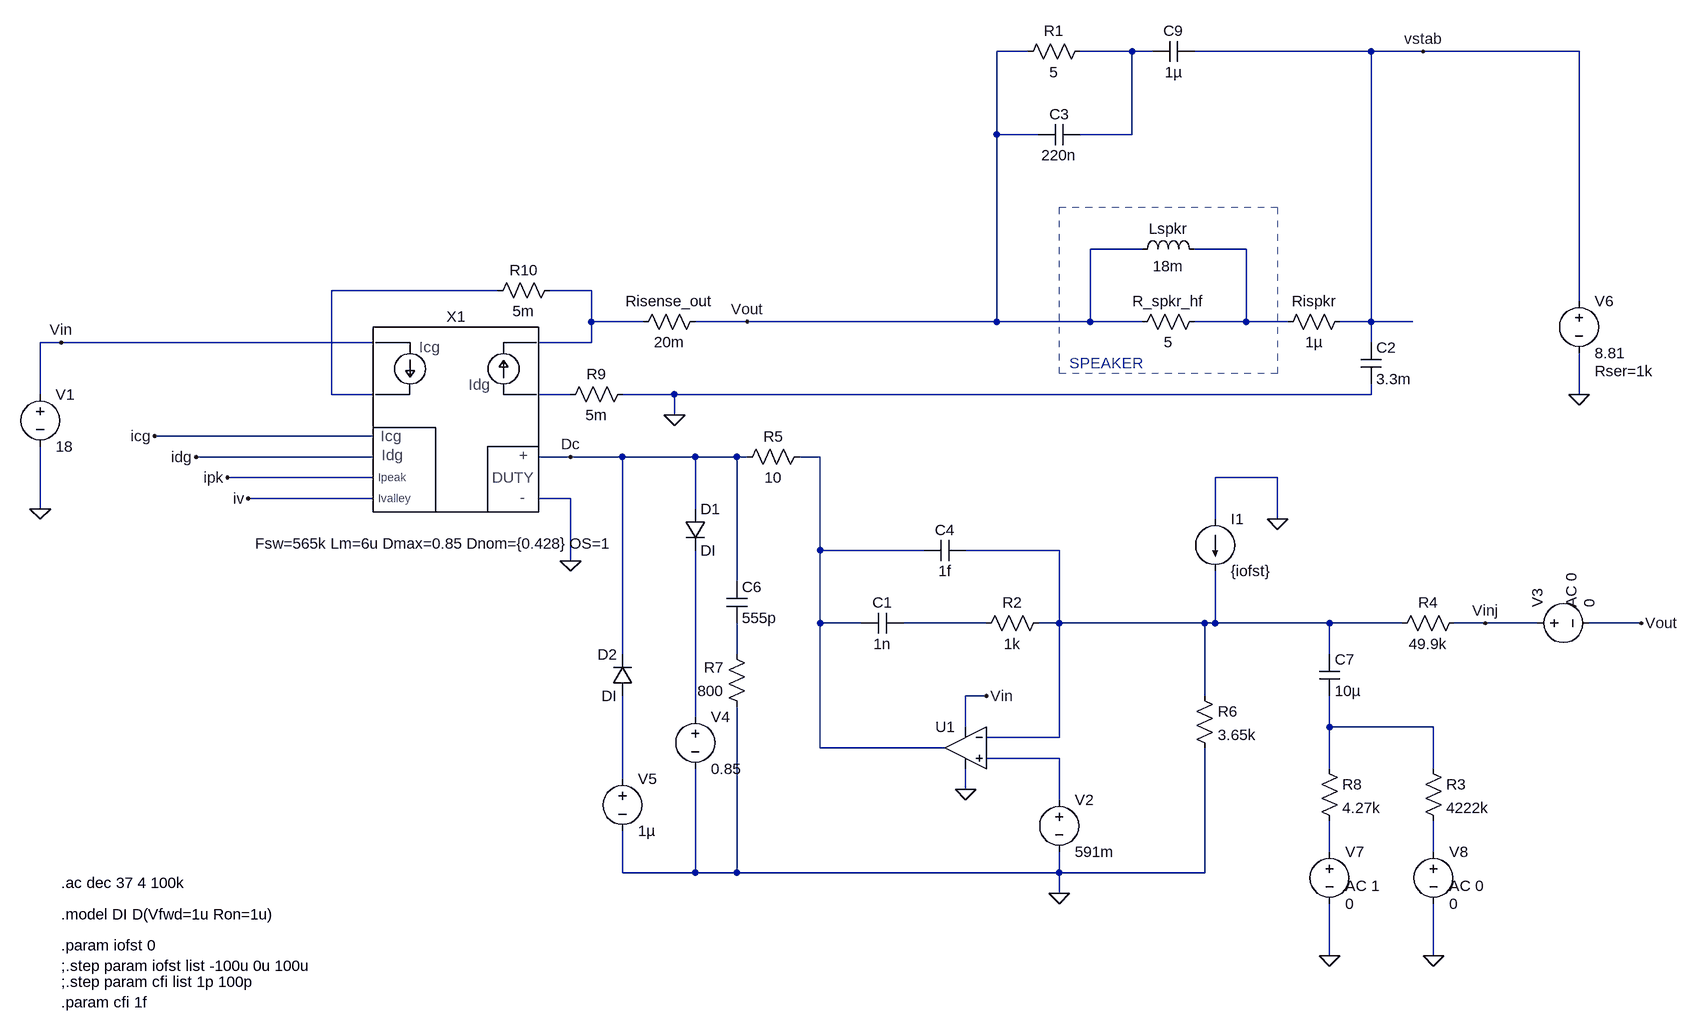
[diagram p0: schematic TPS40195_Power_Amp_AC.asc]
TPS40195_Power_Amp_AC.asc, the LTspice schematic file:
Version 4
SHEET 1 2744 1236
WIRE 1072 -384 1024 -384
WIRE 1232 -384 1152 -384
WIRE 1264 -384 1232 -384
WIRE 1600 -384 1328 -384
WIRE 1680 -384 1600 -384
WIRE 1920 -384 1680 -384
WIRE 1024 -256 1024 -384
WIRE 1088 -256 1024 -256
WIRE 1232 -256 1232 -384
WIRE 1232 -256 1152 -256
WIRE 1248 -80 1168 -80
WIRE 1408 -80 1328 -80
WIRE 256 -16 0 -16
WIRE 400 -16 336 -16
WIRE 1920 0 1920 -384
WIRE 400 32 400 -16
WIRE 480 32 400 32
WIRE 640 32 560 32
WIRE 1024 32 1024 -256
WIRE 1024 32 640 32
WIRE 1168 32 1168 -80
WIRE 1168 32 1024 32
WIRE 1248 32 1168 32
WIRE 1408 32 1408 -80
WIRE 1408 32 1328 32
WIRE 1472 32 1408 32
WIRE 1600 32 1600 -384
WIRE 1600 32 1552 32
WIRE 1664 32 1600 32
WIRE -416 64 -448 64
WIRE 64 64 -416 64
WIRE 400 64 400 32
WIRE 400 64 320 64
WIRE 1600 64 1600 32
WIRE -448 144 -448 64
WIRE 0 144 0 -16
WIRE 64 144 0 144
WIRE 368 144 320 144
WIRE 528 144 448 144
WIRE 1600 144 1600 128
WIRE 1600 144 528 144
WIRE 1920 144 1920 80
WIRE 528 176 528 144
WIRE 64 208 -272 208
WIRE 64 240 -208 240
WIRE 368 240 320 240
WIRE 448 240 368 240
WIRE 560 240 448 240
WIRE 624 240 560 240
WIRE 640 240 624 240
WIRE 752 240 720 240
WIRE 64 272 -160 272
WIRE 1456 272 1360 272
WIRE 64 304 -128 304
WIRE 368 304 320 304
WIRE -448 320 -448 224
WIRE 560 320 560 240
WIRE 1360 336 1360 272
WIRE 1456 336 1456 272
WIRE 752 384 752 240
WIRE 912 384 752 384
WIRE 1120 384 976 384
WIRE 368 400 368 304
WIRE 624 432 624 240
WIRE 752 496 752 384
WIRE 816 496 752 496
WIRE 1008 496 880 496
WIRE 1120 496 1120 384
WIRE 1120 496 1088 496
WIRE 1344 496 1120 496
WIRE 1360 496 1360 416
WIRE 1360 496 1344 496
WIRE 1536 496 1360 496
WIRE 1648 496 1536 496
WIRE 1776 496 1728 496
WIRE 1856 496 1776 496
WIRE 2016 496 1936 496
WIRE 448 544 448 240
WIRE 624 544 624 496
WIRE 1536 544 1536 496
WIRE 1008 608 976 608
WIRE 1344 608 1344 496
WIRE 560 640 560 384
WIRE 976 656 976 608
WIRE 1536 656 1536 608
WIRE 1696 656 1536 656
WIRE 1120 672 1120 496
WIRE 1120 672 1008 672
WIRE 752 688 752 496
WIRE 944 688 752 688
WIRE 1120 704 1008 704
WIRE 1536 720 1536 656
WIRE 1696 720 1696 656
WIRE 448 736 448 608
WIRE 976 752 976 720
WIRE 1120 768 1120 704
WIRE 1536 848 1536 800
WIRE 1696 848 1696 800
WIRE 448 880 448 816
WIRE 560 880 560 720
WIRE 560 880 448 880
WIRE 624 880 624 624
WIRE 624 880 560 880
WIRE 1120 880 1120 848
WIRE 1120 880 624 880
WIRE 1344 880 1344 688
WIRE 1344 880 1120 880
WIRE 1120 912 1120 880
WIRE 1536 1008 1536 928
WIRE 1696 1008 1696 928
FLAG 528 176 0
FLAG -448 320 0
FLAG 640 32 Vout
FLAG -416 64 Vin
FLAG 368 240 Dc
FLAG -272 208 icg
FLAG -208 240 idg
FLAG -160 272 ipk
FLAG -128 304 iv
FLAG 368 400 0
FLAG 976 752 0
FLAG 1008 608 Vin
FLAG 1120 912 0
FLAG 2016 496 Vout
FLAG 1776 496 Vinj
FLAG 1920 144 0
FLAG 1536 1008 0
FLAG 1680 -384 vstab
FLAG 1456 336 0
FLAG 1696 1008 0
DATAFLAG -208 208 ""
DATAFLAG -112 240 ""
DATAFLAG -112 272 ""
DATAFLAG -32 304 ""
DATAFLAG 1088 32 ""
DATAFLAG 1664 32 ""
DATAFLAG 480 240 ""
DATAFLAG 1120 384 ""
DATAFLAG 784 384 ""
SYMBOL voltage -448 128 R0
WINDOW 123 0 0 Left 0
WINDOW 39 0 0 Left 0
SYMATTR InstName V1
SYMATTR Value 18
SYMBOL Duty_Control_IRM 192 144 R0
WINDOW 39 -309 229 Left 2
SYMATTR SpiceLine Fsw=565k Lm=6u Dmax=0.85 Dnom={0.428} OS=1
SYMATTR InstName X1
SYMBOL ind 1232 -64 R270
WINDOW 0 32 56 VTop 2
WINDOW 3 5 56 VBottom 2
SYMATTR InstName Lspkr
SYMATTR Value 18m
SYMATTR SpiceLine Rser=100k
SYMBOL cap 1584 64 R0
SYMATTR InstName C2
SYMATTR Value 3.3m
SYMATTR SpiceLine Rser=20m
SYMBOL cap 1152 -272 R90
WINDOW 0 0 32 VBottom 2
WINDOW 3 32 32 VTop 2
SYMATTR InstName C3
SYMATTR Value 220n
SYMBOL res 1168 -400 R90
WINDOW 0 0 56 VBottom 2
WINDOW 3 32 56 VTop 2
SYMATTR InstName R1
SYMATTR Value 5
SYMBOL Opamps\\UniversalOpamp2 976 688 M0
SYMATTR InstName U1
SYMATTR Value2 Avol=1k GBW=7Meg Slew=10Meg
SYMATTR SpiceLine ilimit=25m rail=0 Vos=0 phimargin=68
SYMBOL voltage 1120 752 R0
WINDOW 123 0 0 Left 0
WINDOW 39 0 0 Left 0
SYMATTR InstName V2
SYMATTR Value 591m
SYMBOL cap 880 480 R90
WINDOW 0 0 32 VBottom 2
WINDOW 3 32 32 VTop 2
SYMATTR InstName C1
SYMATTR Value 1n
SYMBOL res 1104 480 R90
WINDOW 0 0 56 VBottom 2
WINDOW 3 32 56 VTop 2
SYMATTR InstName R2
SYMATTR Value 1k
SYMBOL cap 976 368 R90
WINDOW 0 0 32 VBottom 2
WINDOW 3 32 32 VTop 2
SYMATTR InstName C4
SYMATTR Value 1f
SYMBOL res 1744 480 R90
WINDOW 0 0 56 VBottom 2
WINDOW 3 32 56 VTop 2
SYMATTR InstName R4
SYMATTR Value 49.9k
SYMBOL res 736 224 R90
WINDOW 0 0 56 VBottom 2
WINDOW 3 32 56 VTop 2
SYMATTR InstName R5
SYMATTR Value 10
SYMBOL res 1328 592 R0
SYMATTR InstName R6
SYMATTR Value 3.65k
SYMBOL voltage 1840 496 R270
WINDOW 123 24 68 Left 2
WINDOW 39 0 0 Left 0
SYMATTR Value2 AC 0
SYMATTR InstName V3
SYMATTR Value 0
SYMBOL diode 544 320 R0
SYMATTR InstName D1
SYMATTR Value DI
SYMBOL voltage 560 624 R0
WINDOW 123 0 0 Left 0
WINDOW 39 0 0 Left 0
SYMATTR InstName V4
SYMATTR Value 0.85
SYMBOL diode 464 608 R180
WINDOW 0 24 64 Left 2
WINDOW 3 24 0 Left 2
SYMATTR InstName D2
SYMATTR Value DI
SYMBOL voltage 448 720 R0
WINDOW 123 0 0 Left 0
WINDOW 39 0 0 Left 0
SYMATTR InstName V5
SYMATTR Value 1µ
SYMBOL voltage 1920 -16 R0
WINDOW 123 0 0 Left 0
WINDOW 39 24 124 Left 2
SYMATTR SpiceLine Rser=1k
SYMATTR InstName V6
SYMATTR Value 8.81
SYMBOL cap 608 432 R0
SYMATTR InstName C6
SYMATTR Value 555p
SYMBOL cap 1520 544 R0
SYMATTR InstName C7
SYMATTR Value 10µ
SYMBOL res 1520 704 R0
SYMATTR InstName R8
SYMATTR Value 4.27k
SYMBOL res 464 128 R90
WINDOW 0 0 56 VBottom 2
WINDOW 3 32 56 VTop 2
SYMATTR InstName R9
SYMATTR Value 5m
SYMBOL res 352 -32 R90
WINDOW 0 0 56 VBottom 2
WINDOW 3 32 56 VTop 2
SYMATTR InstName R10
SYMATTR Value 5m
SYMBOL res 1344 16 R90
WINDOW 0 0 56 VBottom 2
WINDOW 3 32 56 VTop 2
SYMATTR InstName R_spkr_hf
SYMATTR Value 5
SYMBOL cap 1328 -400 R90
WINDOW 0 0 32 VBottom 2
WINDOW 3 32 32 VTop 2
SYMATTR InstName C9
SYMATTR Value 1µ
SYMBOL voltage 1536 832 R0
WINDOW 123 24 68 Left 2
WINDOW 39 0 0 Left 0
SYMATTR Value2 AC 1
SYMATTR InstName V7
SYMATTR Value 0
SYMBOL current 1360 336 R0
WINDOW 123 0 0 Left 0
WINDOW 39 0 0 Left 0
SYMATTR InstName I1
SYMATTR Value {iofst}
SYMBOL res 464 48 R270
WINDOW 0 32 56 VTop 2
WINDOW 3 0 56 VBottom 2
SYMATTR InstName Risense_out
SYMATTR Value 20m
SYMBOL res 1456 48 R270
WINDOW 0 32 56 VTop 2
WINDOW 3 0 56 VBottom 2
SYMATTR InstName Rispkr
SYMATTR Value 1µ
SYMBOL res 1680 704 R0
SYMATTR InstName R3
SYMATTR Value 4222k
SYMBOL voltage 1696 832 R0
WINDOW 123 24 68 Left 2
WINDOW 39 0 0 Left 0
SYMATTR Value2 AC 0
SYMATTR InstName V8
SYMATTR Value 0
SYMBOL res 640 640 R180
WINDOW 0 36 76 Left 2
WINDOW 3 36 40 Left 2
SYMATTR InstName R7
SYMATTR Value 800
TEXT -416 944 Left 2 !.model DI D(Vfwd=1u Ron=1u)
TEXT -416 896 Left 2 !.ac dec 37 4 100k
TEXT -416 992 Left 2 !.param iofst 0\n;.step param iofst list -100u 0u 100u
TEXT 1136 96 Left 2 ;SPEAKER
TEXT -416 1048 Left 2 !;.step param cfi list 1p 100p\n.param cfi 1f
RECTANGLE Normal 1456 112 1120 -144 2

The netlist it stands for:
* TPS40195_Power_Amp_AC.asc
V1 Vin 0 18
XX1 Dc 0 Vin N003 N004 N005 icg idg ipk iv Duty_Control_IRM params: Fsw=565k Lm=6u Dmax=0.85 Dnom={0.428} OS=1  ; pins D+ D- Vcg+ Vcg- Vdg+ Vdg- Icharge Idischarge Ipeak Ivalley
Lspkr Vout N002 18m Rser=100k
C2 vstab 0 3.3m Rser=20m
C3 N001 Vout 220n
R1 N001 Vout 5
XU1 N012 N007 Vin 0 N006 level.2 Avol=1k GBW=7Meg Slew=10Meg ilimit=25m rail=0 Vos=0 phimargin=68 en=0 enk=0 in=0 ink=0 Rin=500Meg  ; pins IN+ IN- V+ V- OUT
V2 N012 0 591m
C1 N008 N006 1n
R2 N007 N008 1k
C4 N007 N006 1f
R4 Vinj N007 49.9k
R5 N006 Dc 10
R6 N007 0 3.65k
V3 Vinj Vout 0 AC 0
D1 Dc N010 DI
V4 N010 0 0.85
D2 N013 Dc DI
V5 N013 0 1µ
V6 vstab 0 8.81 Rser=1k
C6 Dc N009 555p
C7 N007 N011 10µ
R8 N011 N014 4.27k
R9 0 N005 5m
R10 N004 N003 5m
R_spkr_hf N002 Vout 5
C9 vstab N001 1µ
V7 N014 0 0 AC 1
I1 0 N007 {iofst}
Risense_out N004 Vout 20m
Rispkr N002 vstab 1µ
R3 N011 N015 4222k
V8 N015 0 0 AC 0
R7 0 N009 800
.model D D
.lib standard.dio
.model DI D(Vfwd=1u Ron=1u)
.ac dec 37 4 100k
.param iofst 0
;.step param iofst list -100u 0u 100u
* SPEAKER
;.step param cfi list 1p 100p
.param cfi 1f
.lib UniversalOpamps2.sub
.backanno
.end